# Altium project H743-Motor.PrjPcb
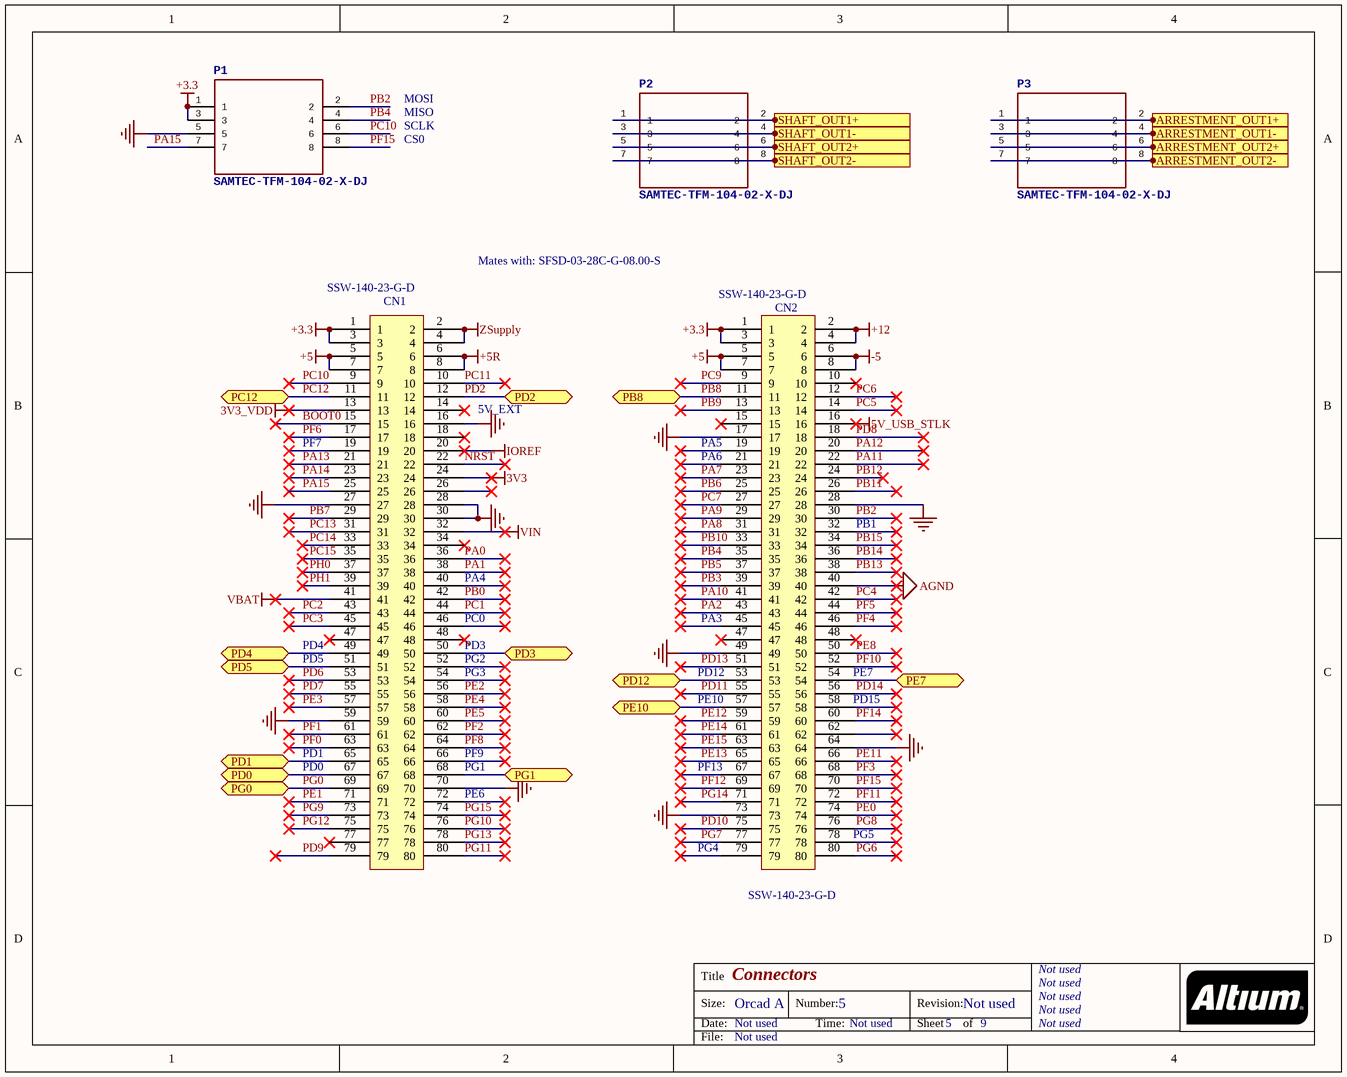
[diagram p0: Connectors.SchDoc]
Board_Assembly_Revision: 01; Board_Document_Date: 17-DEC-2018; Board_Name: NUCLEO 144 H7 LEGACY; Board_PCB_Revision: C; Board_Reference: MB1364
2 sheets, 29 parts. Net scope: flat (ports and power ports of the same name join across sheets).
Board file: MB1364.PcbDoc
Sheets:
  Connectors.SchDoc
  Motors.SchDoc

## Sheet Connectors.SchDoc: Connectors
size OrCAD A; Date: Not used; ApprovedBy: Not used; CheckedBy: Not used; Author: Not used; CompanyName: STMicroelectronics; DrawnBy: Not used; Engineer: Not used; Organization: Not used; Address1: Not used; Address2: Not used; Address3: Not used; Address4: Not used; DocumentNumber: 5; Revision: Not used; SheetNumber: 5; SheetTotal: 9; CurrentTime: Not used; CurrentDate: Not used; Time: Not used; DocumentFullPathAndName: Not used; DocumentName: Not used; ModifiedDate: Not used; ImagePath: Not used; ProjectName: Not used; Application_BuildNumber: Not used

### Parts
CN1  SSW-140-23-G-D  [SSW-140-23-G-D]
CN2  SSW-140-23-G-D  [SSW-140-23-G-D]
P1  SAMTEC-TFM-104-02-X-DJ  [SAMTEC-TFM-104-02-X-D]
P2  SAMTEC-TFM-104-02-X-DJ  [SAMTEC-TFM-104-02-X-D]
P3  SAMTEC-TFM-104-02-X-DJ  [SAMTEC-TFM-104-02-X-D]

### Ports
ARRESTMENT_OUT1+, ARRESTMENT_OUT1-, ARRESTMENT_OUT2+, ARRESTMENT_OUT2-, PB8, PC12, PD0, PD1, PD2, PD3, PD4, PD5, PD12, PE7, PE10, PG0, PG1, SHAFT_OUT1+, SHAFT_OUT1-, SHAFT_OUT2+, SHAFT_OUT2-

### Nets
3V3: CN1.24
3V3_VDD: CN1.13
5V_USB_STLK: CN2.16
+3.3: CN1.1 CN1.3 CN2.1 CN2.3 P1.1 P1.3
+5: CN1.5 CN1.7 CN2.5 CN2.7
+5R: CN1.6 CN1.8
+12: CN2.2 CN2.4
-5: CN2.6 CN2.8
AGND: CN2.40
GND: CN1.16 CN1.27 CN1.28 CN1.30 CN1.59 CN1.70 CN2.17 CN2.28 CN2.49 CN2.64 CN2.73 P1.5
IOREF: CN1.20
VBAT: CN1.41
VIN: CN1.32
ZSupply: CN1.2 CN1.4
ARRESTMENT_OUT1+: P3.1 P3.2 ; port ARRESTMENT_OUT1+
ARRESTMENT_OUT1-: P3.3 P3.4 ; port ARRESTMENT_OUT1-
ARRESTMENT_OUT2+: P3.5 P3.6 ; port ARRESTMENT_OUT2+
ARRESTMENT_OUT2-: P3.7 P3.8 ; port ARRESTMENT_OUT2-
BOOT0: CN1.15
NRST: CN1.22
PA0: CN1.36
PA1: CN1.38
PA2: CN2.43
PA7: CN2.23
PA8: CN2.31
PA9: CN2.29
PA10: CN2.41
PA11: CN2.22
PA12: CN2.20
PA13: CN1.21
PA14: CN1.23
PA15: CN1.25 P1.7
PB0: CN1.42
PB2: CN2.30 P1.2
PB3: CN2.39
PB4: CN2.35 P1.4
PB5: CN2.37
PB6: CN2.25
PB7: CN1.29
PB8: CN2.11 ; port PB8
PB9: CN2.13
PB10: CN2.33
PB11: CN2.26
PB12: CN2.24
PB13: CN2.38
PB14: CN2.36
PB15: CN2.34
PC1: CN1.44
PC2: CN1.43
PC3: CN1.45
PC4: CN2.42
PC5: CN2.14
PC6: CN2.12
PC7: CN2.27
PC9: CN2.9
PC10: CN1.9 P1.6
PC11: CN1.10
PC12: CN1.11 ; port PC12
PC13: CN1.31
PC14: CN1.33
PC15: CN1.35
PD0: CN1.67 ; port PD0
PD1: CN1.65 ; port PD1
PD2: CN1.12 ; port PD2
PD3: CN1.50 ; port PD3
PD4: CN1.49 ; port PD4
PD5: CN1.51 ; port PD5
PD6: CN1.53
PD7: CN1.55
PD8: CN2.18
PD9: CN1.79
PD10: CN2.75
PD11: CN2.55
PD12: CN2.53 ; port PD12
PD13: CN2.51
PD14: CN2.56
PE0: CN2.74
PE1: CN1.71
PE2: CN1.56
PE3: CN1.57
PE4: CN1.58
PE5: CN1.60
PE7: CN2.54 ; port PE7
PE8: CN2.50
PE10: CN2.57 ; port PE10
PE11: CN2.66
PE12: CN2.59
PE13: CN2.65
PE14: CN2.61
PE15: CN2.63
PF0: CN1.63
PF1: CN1.61
PF2: CN1.62
PF3: CN2.68
PF4: CN2.46
PF5: CN2.44
PF6: CN1.17
PF8: CN1.64
PF10: CN2.52
PF11: CN2.72
PF12: CN2.69
PF14: CN2.60
PF15: CN2.70 P1.8
PG0: CN1.69 ; port PG0
PG1: CN1.68 ; port PG1
PG6: CN2.80
PG7: CN2.77
PG8: CN2.76
PG9: CN1.73
PG10: CN1.76
PG11: CN1.80
PG12: CN1.75
PG13: CN1.78
PG14: CN2.71
PG15: CN1.74
PH0: CN1.37
PH1: CN1.39
SHAFT_OUT1+: P2.1 P2.2 ; port SHAFT_OUT1+
SHAFT_OUT1-: P2.3 P2.4 ; port SHAFT_OUT1-
SHAFT_OUT2+: P2.5 P2.6 ; port SHAFT_OUT2+
SHAFT_OUT2-: P2.7 P2.8 ; port SHAFT_OUT2-

Not connected (* = marked no-connect by the designer): CN1 14* 18* 19* 26* 34* 40* 46* 47* 48* 52* 54* 66* 72* 77*; CN2 10* 15* 19* 21* 32* 45* 47* 48* 58* 62* 67* 78* 79*

### Notes on the sheet
- MOSI
- MISO
- SCLK
- CS0
- Mates with: SFSD-03-28C-G-08.00-S
- 5V_EXT
- (near CN1) PF7
- (near CN2) PA6
- (near CN2) PA5
- (near CN2) PB1
- (near CN1) PA4
- (near CN1) PC0
- (near CN2) PA3
- (near CN1) PD4
- (near CN1) PD5
- (near CN1) PG2
- (near CN1) PG3
- (near CN1) PD3
- (near CN2) PD12
- (near CN2) PE7
- (near CN1) PD1
- (near CN1) PF9
- (near CN2) PE10
- (near CN2) PD15
- (near CN1) PD0
- (near CN1) PE6
- (near CN1) PG1
- (near CN2) PF13
- (near CN2) PG4
- (near CN2) PG5
- Title
- Size:
- Date:
- Orcad A
- Number:
- Time:
- Revision:
- Sheet
- of
- File:

### Library data of the parts
CN1 CN2 = SSW-140-23-G-D: 80 Position Receptacle Connector Through Hole; Manufacturer: Samtec; Number of Contacts: 80; Gender: Female; Pitch: 2.54mm; Supplier 1: Avnet; Supplier Part Number 1: SSW-140-23-G-D; Manufacturer Part Number: SSW-140-23-G-D; Stock 1: 0; Pricing 1: 1=13.99000, 10=13.29000, 25=12.59000, 50=12.09000, 100=11.29000 (USD); RoHS: Yes; Mount: Through Hole; Contact Plating: Gold; Number of Rows: 2; Packaging: Bulk; Termination: Solder; Radiation Hardening: No; ComponentLink1URL: http://www.samtec.com/documents/webfiles/pdf/SSQ_TH.PDF?src-supplier=Avnet; ComponentLink1Description: http://www.samtec.com/documents/webfiles/pdf/SSQ_TH.PDF?src-supplier=Avnet

## Sheet Motors.SchDoc
size OrCAD A
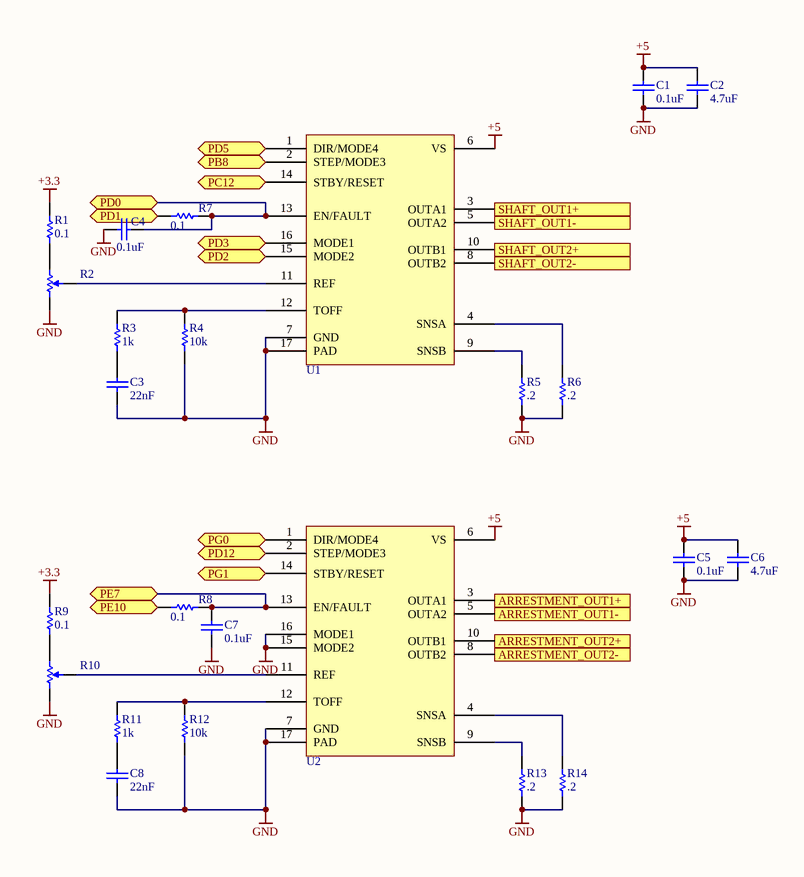
[diagram p1: Motors.SchDoc]

### Parts
C1  0.1uF  [CAPC1608X94X35LL15T15]
C2  4.7uF  [CAPC0603(1608)55_M]
C3  22nF  [CAPC1608X94X35LL15T15]
C4  0.1uF  [CAPC1608X94X35LL15T15]
C5  0.1uF  [CAPC1608X94X35LL15T15]
C6  4.7uF  [CAPC0603(1608)55_M]
C7  0.1uF  [CAPC1608X94X35LL15T15]
C8  22nF  [CAPC1608X94X35LL15T15]
R1  0.1  [RESC0603(1608)_N]
R2  3313J-1-503E  [BOUR-3313J-1_V]  (value not drawn)
R3  1k  [RESC0603(1608)_N]
R4  10k  [RESC0603(1608)_N]
R5  .2  [RESC0603(1608)_N]
R6  .2  [RESC0603(1608)_N]
R7  0.1  [RESC0603(1608)_N]
R8  0.1  [RESC0603(1608)_N]
R9  0.1  [RESC0603(1608)_N]
R10  3313J-1-503E  [BOUR-3313J-1_V]  (value not drawn)
R11  1k  [RESC0603(1608)_N]
R12  10k  [RESC0603(1608)_N]
R13  .2  [RESC0603(1608)_N]
R14  .2  [RESC0603(1608)_N]
U1  STSPIN220  [STSPIN220-QFN127P600-8N]  (value not drawn)
U2  STSPIN220  [STSPIN220-QFN127P600-8N]  (value not drawn)

### Ports
ARRESTMENT_OUT1+, ARRESTMENT_OUT1-, ARRESTMENT_OUT2+, ARRESTMENT_OUT2-, PB8, PC12, PD0, PD1, PD2, PD3, PD5, PD12, PE7, PE10, PG0, PG1, SHAFT_OUT1+, SHAFT_OUT1-, SHAFT_OUT2+, SHAFT_OUT2-

### Nets
+3.3: R1.2 R9.2
+5: C1.1 C2.2 C5.1 C6.2 U1.6(VS) U2.6(VS)
GND: C1.2 C2.1 C3.2 C4.1 C5.2 C6.1 C7.1 C8.2 R2.1 R4.1 R5.1 R6.1 R10.1 R12.1 R13.1 R14.1 U1.7(GND) U1.17(PAD) U2.7(GND) U2.15(MODE2) U2.16(MODE1) U2.17(PAD)
ARRESTMENT_OUT1+: U2.3(OUTA1) ; port ARRESTMENT_OUT1+
ARRESTMENT_OUT1-: U2.5(OUTA2) ; port ARRESTMENT_OUT1-
ARRESTMENT_OUT2+: U2.10(OUTB1) ; port ARRESTMENT_OUT2+
ARRESTMENT_OUT2-: U2.8(OUTB2) ; port ARRESTMENT_OUT2-
PB8: U1.2(STEP/MODE3) ; port PB8
PC12: U1.14(STBY/RESET) ; port PC12
PD0: C4.2 R7.1 U1.13(EN/FAULT) ; port PD0
PD1: R7.2 ; port PD1
PD2: U1.15(MODE2) ; port PD2
PD3: U1.16(MODE1) ; port PD3
PD5: U1.1(DIR/MODE4) ; port PD5
PD12: U2.2(STEP/MODE3) ; port PD12
PE7: C7.2 R8.1 U2.13(EN/FAULT) ; port PE7
PE10: R8.2 ; port PE10
PG0: U2.1(DIR/MODE4) ; port PG0
PG1: U2.14(STBY/RESET) ; port PG1
SHAFT_OUT1+: U1.3(OUTA1) ; port SHAFT_OUT1+
SHAFT_OUT1-: U1.5(OUTA2) ; port SHAFT_OUT1-
SHAFT_OUT2+: U1.10(OUTB1) ; port SHAFT_OUT2+
SHAFT_OUT2-: U1.8(OUTB2) ; port SHAFT_OUT2-
NetC3_1: C3.1 R3.1
NetC8_1: C8.1 R11.1
NetR1_1: R1.1 R2.3
NetR2_2: R2.2 U1.11(REF)
NetR3_2: R3.2 R4.2 U1.12(TOFF)
NetR5_2: R5.2 U1.9(SNSB)
NetR6_2: R6.2 U1.4(SNSA)
NetR9_1: R9.1 R10.3
NetR10_2: R10.2 U2.11(REF)
NetR11_2: R11.2 R12.2 U2.12(TOFF)
NetR13_2: R13.2 U2.9(SNSB)
NetR14_2: R14.2 U2.4(SNSA)

### Notes on the sheet
- Title
- Size:
- Date:
- Orcad A
- Number:
- Time:
- Revision:
- Sheet
- of
- ZLS Corporation
- 7801 North Lamar Blvd.
- Suite E-184
- Austin, Texas 78752  USA
- (512) 453-0288
- File:

### Library data of the parts
C1 C3-C5 C7 C8 = CMP-1661-00001-2: CAP .1UF 16V CERAMIC X7R 0603; Manufacturer: Yageo; Manufacturer Part Number: CC0603KRX7R7BB105; Capacitance: 1uF; Tolerance: 10%; Dissipation Factor: 5%; ComponentLink1Description: Datasheet; ComponentLink1URL: http://datasheets.avx.com/X7RDielectric.pdf; Supplier 1: Digi-Key; Supplier Part Number 1: 311-1446-6-ND; Stock 1: 5506121; Pricing 1: 1=0.21, 10=0.143, 100=0.0727, 500=0.04974, 1000=0.044 (USD); Mount: Surface Mount; Case/Package: 0603; Number of Pins: 2; Case Code (Metric): 1608; Case Code (Imperial): 0603; Min Operating Temperature: -55°C; Max Operating Temperature: 125°C; Voltage Rating: 16V; Package Quantity: 1; Packaging: Tape and Reel; Voltage Rating (DC): 16V; Dielectric: X7R; Termination: SMD/SMT; Voltage: 16V; Composition: Ceramic; Length: 1.6mm; Height: 0.8mm; Width: 0.031inch; Thickness: 0.035inch; Depth: 0.8mm; Radiation Hardening: No; REACH SVHC: Unknown; Lead Free: Lead Free; Halogen Free: Halogen Free; ComponentLink2URL: http://www.yageo.com/documents/recent/UPY-GPHC_X7R_6.3V-to-50V_18.pdf; ComponentLink2Description: http://www.yageo.com/documents/recent/UPY-GPHC_X7R_6.3V-to-50V_18.pdf; ComponentLink3URL: http://www.yageo.com/documents/recent/UPY-GPHC_X7R_6.3V-to-50V_8.pdf; ComponentLink3Description: http://www.yageo.com/documents/recent/UPY-GPHC_X7R_6.3V-to-50V_8.pdf; ComponentLink4URL: http://www.farnell.com/datasheets/1734573.pdf; ComponentLink4Description: http://www.farnell.com/datasheets/1734573.pdf; ComponentLink5URL: http://www.farnell.com/datasheets/1489800.pdf; ComponentLink5Description: http://www.farnell.com/datasheets/1489800.pdf
C2 C6 = CMP-1035-02779-1: CAP 4.7uF 6.3V ±10% 0603 (1608 Metric) Thickness 0.55mm SMD; Manufacturer: KEMET; Manufacturer Part Number: C0603C475K9PACTU; Case-EIA: 0603; Tolerance: Â±10%; Case-Metric: 1608; Dielectric Material: Ceramic; Dielectric: X5R; Dissipation Factor: 5%; Technology: SMT; Value: 4.7uF; Max Thickness: 0.55 mm; Rated Voltage: 6.3 V; Supplier 1: Digi-Key; Supplier Part Number 1: 399-3482-6-ND; Stock 1: 1765509; Pricing 1: 1=0.21, 10=0.15, 100=0.0706, 500=0.04952, 1000=0.041 (USD); Mount: PCB,Surface Mount; Case/Package: 0603; Number of Pins: 2; Case Code (Metric): 1608; Case Code (Imperial): 0603; Contact Plating: Matte,Tin; Min Operating Temperature: -55°C; Max Operating Temperature: 85°C; Package Quantity: 1; Capacitance: 4.7uF; Voltage Rating: 6.3V; Packaging: Tape and Reel; Termination: SMD/SMT; Voltage Rating (DC): 6.3V; Voltage: 6.3V; Length: 1.6mm; Height: 0.8mm; Width: 0.031inch; Thickness: 0.035inch; Depth: 0.8mm; Lead Pitch: 0.7mm; Radiation Hardening: No; Lead Free: Lead Free; REACH SVHC: No SVHC; ComponentLink1URL: https://api.kemet.com/component-edge/download/datasheet/C0603C475K9PACTU.pdf; ComponentLink1Description: https://api.kemet.com/component-edge/download/datasheet/C0603C475K9PACTU.pdf; ComponentLink2URL: http://www.farnell.com/datasheets/1732700.pdf; ComponentLink2Description: http://www.farnell.com/datasheets/1732700.pdf; ComponentLink3URL: http://www.farnell.com/datasheets/1789732.pdf; ComponentLink3Description: http://www.farnell.com/datasheets/1789732.pdf; ComponentLink4URL: http://www.farnell.com/datasheets/40889.pdf; ComponentLink4Description: http://www.farnell.com/datasheets/40889.pdf
R1 R3-R9 R11-R14 = CMP-1012-00511-1: 0R12 0.1W 1% 0603 (1608 Metric)  SMD; Manufacturer: Vishay; Manufacturer Part Number: CRCW060310K0FKEA; Value: 1020.00 Ohm; Case-EIA: 0603; Case-Metric: 1608; Resistance: 10kR; Power Rating: 100mW; Voltage Rating: 75V; Temperature Coefficient: 100ppm/°C; Technology: SMT; Power: 0.1 W; Tolerance: 1 %; Supplier 1: Digi-Key; Supplier Part Number 1: 311-0.0GRDKR-ND; Stock 1: 49641653; Pricing 1: 1=0.1, 10=0.021, 25=0.0152, 50=0.0114, 100=0.0084, 250=0.00644, 500=0.00514, 1000=0.00379 (USD); Case/Package: 0603; Number of Pins: 2; Weight: 7.1E-05oz; Case Code (Metric): 1608; Case Code (Imperial): 0603; Contact Plating: Lead,Tin; Min Operating Temperature: -55°C; Max Operating Temperature: 155°C; Packaging: Tape and Reel; Package Quantity: 10; Composition: Thick Film; Military Standard: Not; Termination: SMD/SMT; Voltage Rating (DC): 75V; Number of Terminations: 2; Max Power Dissipation: 100mW; Features: Automotive AEC-Q200; Length: 1.55mm; Height: 0.45mm; Width: 0.033inch; Depth: 0.85mm; Radiation Hardening: No; REACH SVHC: Unknown; Lead Free: Lead Free; ComponentLink1URL: http://www.vishay.com/docs/20008/dcrcw.pdf; ComponentLink1Description: http://www.vishay.com/docs/20008/dcrcw.pdf; ComponentLink2URL: https://www.verical.com/server-webapp/html/getDatasheet?partID=86831; ComponentLink2Description: https://www.verical.com/server-webapp/html/getDatasheet?partID=86831; ComponentLink3URL: http://www.farnell.com/datasheets/2310790.pdf; ComponentLink3Description: http://www.farnell.com/datasheets/2310790.pdf; ComponentLink4URL: http://www.vishay.com/docs/20035/dcrcwe3.pdf; ComponentLink4Description: http://www.vishay.com/docs/20035/dcrcwe3.pdf; ComponentLink5URL: http://www.farnell.com/datasheets/2111203.pdf; ComponentLink5Description: http://www.farnell.com/datasheets/2111203.pdf; ComponentLink6URL: http://uk.rs-online.com/webdocs/0d98/0900766b80d98afc.pdf; ComponentLink6Description: http://uk.rs-online.com/webdocs/0d98/0900766b80d98afc.pdf
R2 R10 = CMP-2000-05588-1: 3 mm Trimpot(R) Trimming Potentiometer, 50 KOhm, +/- 20%, 0.125 W, -55 to 125 degC, 3-Pin SMD, RoHS, Tape and Reel; Manufacturer: Bourns; SVHC: NoSVHC(19-Dec-2012); Temperature Coefficient: ±150ppm/°C; No. of Turns: 1; Power Rating: 125mW; Track Resistance: 50kohm; Manufacturer URL: http://www.bourns.com/; Potentiometer Mounting: SMD; Package Description: 3-Pin Surface Mount Device, Body 3.5 x 3.2 mm, Pitch 1.15 mm; Package Reference: 3313J-1; Mounting Technology: SurfaceMount; Resistance Tolerance: ±20%; Datasheet Version: 05/2016; Datasheet URL: http://www.bourns.com/docs/Product-Datasheets/3313.pdf

## Nets that join several sheets
+3.3: Connectors (6 pins), Motors (R1.2 R9.2)
+5: Connectors (CN1.5 CN1.7 CN2.5 CN2.7), Motors (6 pins)
GND: Connectors (12 pins), Motors (22 pins)
ARRESTMENT_OUT1+: Connectors (P3.1 P3.2), Motors (U2.3)
ARRESTMENT_OUT1-: Connectors (P3.3 P3.4), Motors (U2.5)
ARRESTMENT_OUT2+: Connectors (P3.5 P3.6), Motors (U2.10)
ARRESTMENT_OUT2-: Connectors (P3.7 P3.8), Motors (U2.8)
PB8: Connectors (CN2.11), Motors (U1.2)
PC12: Connectors (CN1.11), Motors (U1.14)
PD0: Connectors (CN1.67), Motors (C4.2 R7.1 U1.13)
PD1: Connectors (CN1.65), Motors (R7.2)
PD2: Connectors (CN1.12), Motors (U1.15)
PD3: Connectors (CN1.50), Motors (U1.16)
PD5: Connectors (CN1.51), Motors (U1.1)
PD12: Connectors (CN2.53), Motors (U2.2)
PE7: Connectors (CN2.54), Motors (C7.2 R8.1 U2.13)
PE10: Connectors (CN2.57), Motors (R8.2)
PG0: Connectors (CN1.69), Motors (U2.1)
PG1: Connectors (CN1.68), Motors (U2.14)
SHAFT_OUT1+: Connectors (P2.1 P2.2), Motors (U1.3)
SHAFT_OUT1-: Connectors (P2.3 P2.4), Motors (U1.5)
SHAFT_OUT2+: Connectors (P2.5 P2.6), Motors (U1.10)
SHAFT_OUT2-: Connectors (P2.7 P2.8), Motors (U1.8)

## Assembly variants
H743ZI: not fitted C62 C63 C69 C70 C71 C72 CN2 CN11 CN12 R35 R54 R55 R67 SB3 SB4 SB5 SB7 SB9 SB10 SB14 SB15 SB16 SB17 SB18 SB20 SB33 SB34 SB37 SB40 SB41 SB44 SB46 SB47 SB49 SB50 SB55 SB58 SB61 SB62 SB65 SB66 SB69 SB70 SB78 SB79 X3
H7A3ZI: not fitted C62 C63 C69 C70 C71 C72 C73 C74 C75 C76 C77 C78 C79 C80 C81 C82 C83 C85 CN2 CN11 CN12 CN14 HW3 JP6 L1 R35 R40 R41 R42 R43 R44 R45 R46 R47 R48 R49 R50 R51 R52 R53 R54 R55 R57 R58 R59 R67 R75 R76 R77 R78 SB3 SB4 SB5 SB7 SB9 SB10 SB14 SB15 SB16 SB17 SB18 SB20 SB27 SB29 SB30 SB31 SB34 SB35 SB36 SB38 SB40 SB41 SB44 SB46 SB47 SB48 SB54 SB55 SB57 SB58 SB60 SB61 SB62 SB64 SB66 SB69 SB70 SB72 SB74 SB78 SB79 U15 U16 U17 X3 X4
H7B3ZI: not fitted C62 C63 C69 C70 C71 C72 C73 C74 C75 C76 C77 C78 C79 C80 C81 C82 C83 C85 CN2 CN11 CN12 CN14 HW3 JP6 L1 R35 R40 R41 R42 R43 R44 R45 R46 R47 R48 R49 R50 R51 R52 R53 R54 R55 R57 R58 R59 R67 R75 R76 R77 R78 SB3 SB4 SB5 SB7 SB9 SB10 SB14 SB15 SB16 SB17 SB18 SB20 SB27 SB29 SB30 SB31 SB34 SB35 SB36 SB38 SB40 SB41 SB44 SB46 SB47 SB48 SB54 SB55 SB57 SB58 SB60 SB61 SB62 SB64 SB66 SB69 SB70 SB72 SB74 SB78 SB79 U15 U16 U17 X3 X4
H753ZI: not fitted C62 C63 C69 C70 C71 C72 CN2 CN11 CN12 R35 R54 R55 R67 SB3 SB4 SB5 SB7 SB9 SB10 SB14 SB15 SB16 SB17 SB18 SB20 SB33 SB34 SB37 SB40 SB41 SB44 SB46 SB47 SB49 SB50 SB55 SB58 SB61 SB62 SB65 SB66 SB69 SB70 SB78 SB79 X3